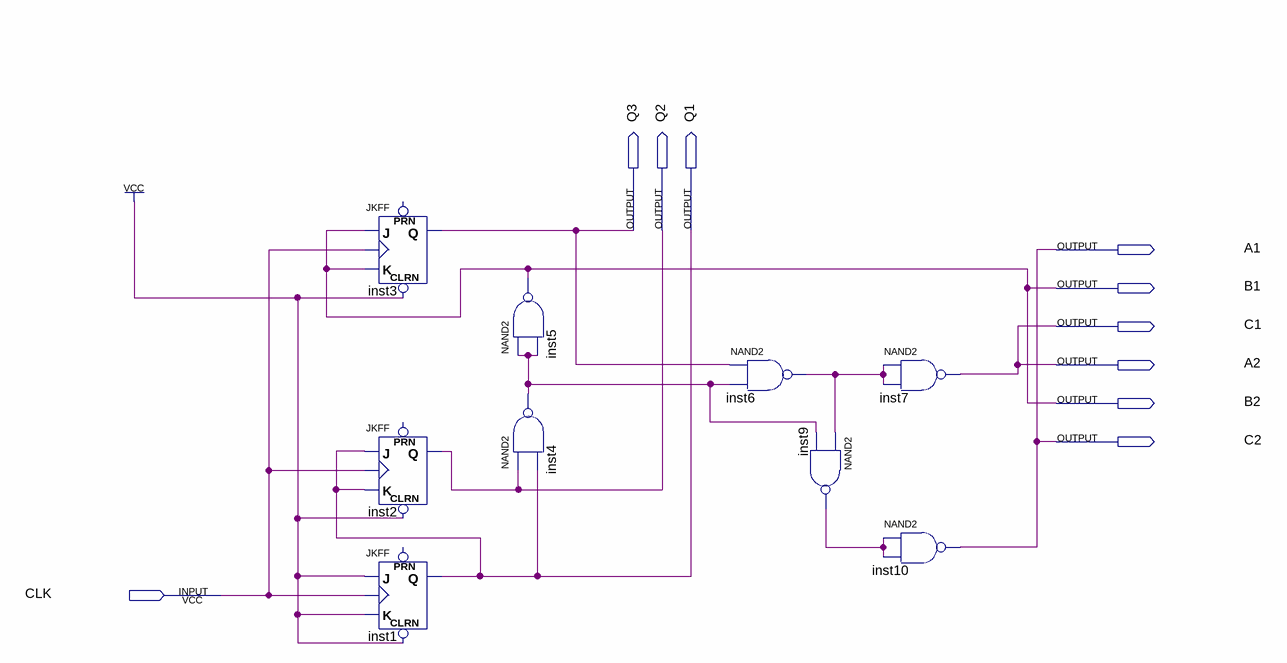
[diagram p0: schematic sheet]
// Quartus schematic project1.bdf as structural Verilog: 9 symbols, 10 pins
module project1 (
  input  CLK,
  output Q3,
  output Q2,
  output Q1,
  output A1,
  output B1,
  output C1,
  output A2,
  output B2,
  output C2
);

  wire inst4_out, inst6_out, inst9_out;

  JKFF inst3 (.CLRN(1'b1), .K(B1), .J(B1), .CLK(CLK), .Q(Q3));  // open: PRN
  JKFF inst2 (.CLRN(1'b1), .K(Q1), .J(Q1), .CLK(CLK), .Q(Q2));  // open: PRN
  JKFF inst1 (.CLRN(1'b1), .K(1'b1), .J(1'b1), .CLK(CLK), .Q(Q1));  // open: PRN
  nand inst5 (B1, inst4_out, inst4_out);
  nand inst4 (inst4_out, Q2, Q1);
  nand inst6 (inst6_out, Q3, inst4_out);
  nand inst9 (inst9_out, inst6_out, inst4_out);
  nand inst7 (A2, inst6_out, inst6_out);
  nand inst10 (A1, inst9_out, inst9_out);

  assign B2 = B1;
  assign C1 = A2;
  assign C2 = A1;
endmodule
